# EAGLE design sensors (EAGLE 7.7.0)
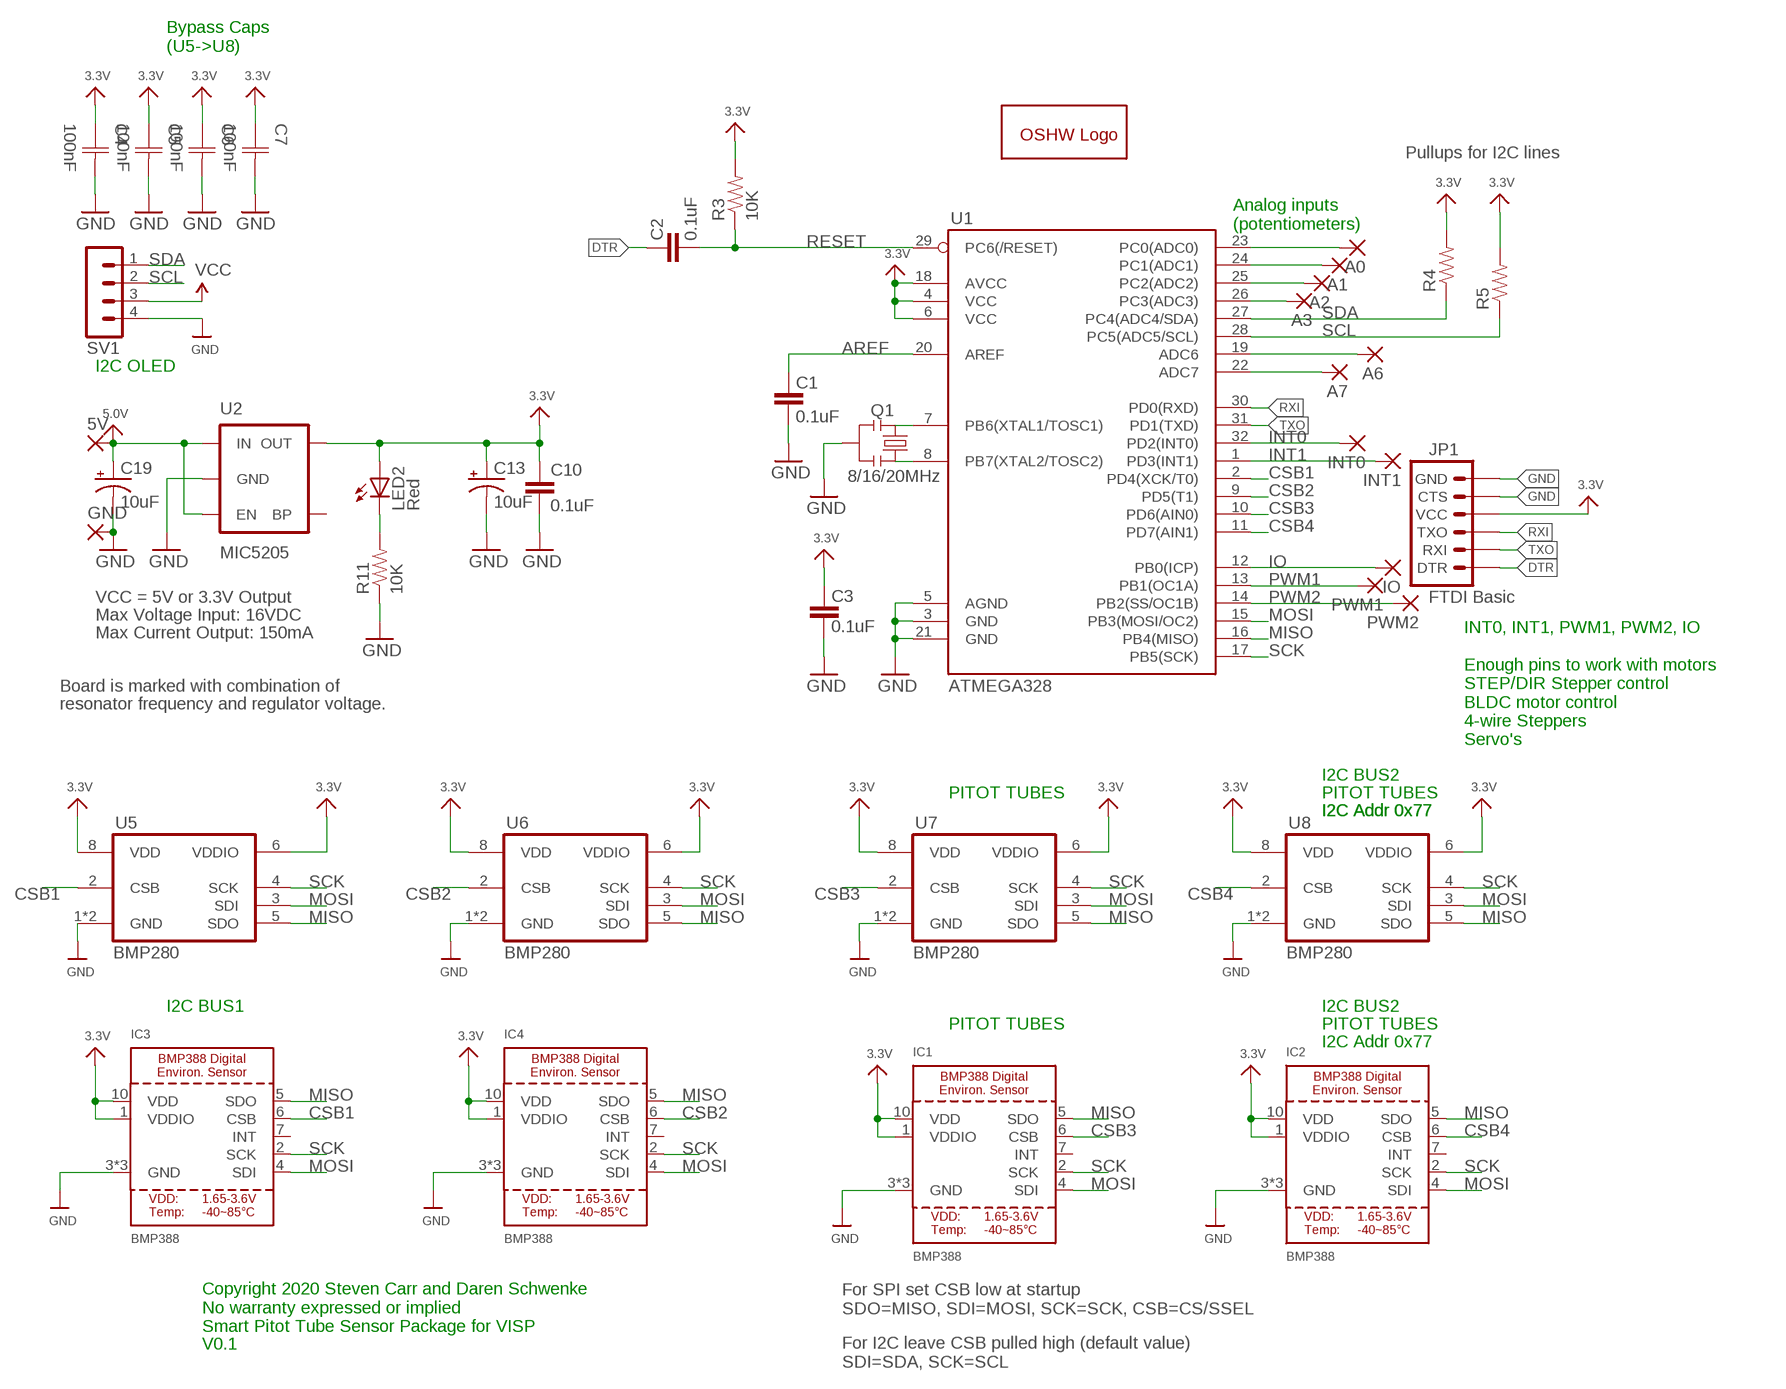
[diagram p0: schematic, sheet 1]

## Parts
5V  SMD2  [SMD1,27-2,54]
A0  SMD2  [SMD1,27-2,54]
A1  SMD2  [SMD1,27-2,54]
A2  SMD2  [SMD1,27-2,54]
A3  SMD2  [SMD1,27-2,54]
A6  SMD2  [SMD1,27-2,54]
A7  SMD2  [SMD1,27-2,54]
C1  0.1uF  CAP0603-CAP  [0603-CAP]
C2  0.1uF  CAP0603-CAP  [0603-CAP]
C3  0.1uF  CAP0603-CAP  [0603-CAP]
C4  100nF  CAPACITOR-0402  [CAP0402]
C5  100nF  CAPACITOR-0402  [CAP0402]
C6  100nF  CAPACITOR-0402  [CAP0402]
C7  100nF  CAPACITOR-0402  [CAP0402]
C10  0.1uF  CAP0603-CAP  [0603-CAP]
C13  10uF  CAP_POL1206  [EIA3216]
C19  10uF  CAP_POL1206  [EIA3216]
GND  SMD2  [SMD1,27-2,54]
GOLD_ORB_SM1  OSHWLOGOLOGO8MM  [OSHW_8MM]
IC1  BMP388  [BMP388]
IC2  BMP388  [BMP388]
IC3  BMP388  [BMP388]
IC4  BMP388  [BMP388]
INT0  SMD2  [SMD1,27-2,54]
INT1  SMD2  [SMD1,27-2,54]
IO  SMD2  [SMD1,27-2,54]
JP1  FTDI Basic  ARDUINO_SERIAL_PROGRAMPTH  [1X06]
LED2  Red  LED  [0603-LED-ALT1]
PWM1  SMD2  [SMD1,27-2,54]
PWM2  SMD2  [SMD1,27-2,54]
Q1  8/16/20MHz  RESONATOR1:1  [RESONATOR-SMD-1:1]
R3  10K  RESISTOR0603-RES  [0603-RES]
R4  RESISTOR0603-RES  [0603-RES]
R5  RESISTOR0603-RES  [0603-RES]
R11  10K  RESISTOR0603-RES  [0603-RES]
SV1  MA04-1  [MA04-1]
U1  ATMEGA328  ATMEGA168  [TQFP32-08]
U2  MIC5205  V_REG_LDOSMD  [SOT23-5]
U5  BMP280  [BMP280]
U6  BMP280  [BMP280]
U7  BMP280  [BMP280]
U8  BMP280  [BMP280]

## Nets
3.3V: C3.2 C4.1(C1) C5.1(C1) C6.1(C1) C7.1(C1) C10.1 C13.A(+) IC1.1(VDDIO) IC1.10(VDD) IC2.1(VDDIO) IC2.10(VDD) IC3.1(VDDIO) IC3.10(VDD) IC4.1(VDDIO) IC4.10(VDD) JP1.4(VCC) LED2.A R3.2 R4.2 R5.2 SV1.3 U1.4(VCC) U1.6(VCC) U1.18(AVCC) U2.5(OUT) U5.6(VDDIO) U5.8(VDD) U6.6(VDDIO) U6.8(VDD) U7.6(VDDIO) U7.8(VDD) U8.6(VDDIO) U8.8(VDD) ; supply symbol labelled VCC
5.0V: 5V.1(P) C19.A(+) U2.1(IN) U2.3(EN)
A0: A0.1(P) U1.23(PC0(ADC0))
A1: A1.1(P) U1.24(PC1(ADC1))
A2: A2.1(P) U1.25(PC2(ADC2))
A3: A3.1(P) U1.26(PC3(ADC3))
A6: A6.1(P) U1.19(ADC6)
A7: A7.1(P) U1.22(ADC7)
AREF: C1.2 U1.20(AREF)
CSB1: IC3.6(CSB) U1.2(PD4(XCK/T0)) U5.2(CSB)
CSB2: IC4.6(CSB) U1.9(PD5(T1)) U6.2(CSB)
CSB3: IC1.6(CSB) U1.10(PD6(AIN0)) U7.2(CSB)
CSB4: IC2.6(CSB) U1.11(PD7(AIN1)) U8.2(CSB)
DTR: C2.2 JP1.1(DTR)
GND: C1.1 C3.1 C4.2(C2) C5.2(C2) C6.2(C2) C7.2(C2) C10.2 C13.C(-) C19.C(-) GND.1(P) IC1.3(GND) IC1.8(GND) IC1.9(GND) IC2.3(GND) IC2.8(GND) IC2.9(GND) IC3.3(GND) IC3.8(GND) IC3.9(GND) IC4.3(GND) IC4.8(GND) IC4.9(GND) JP1.5(CTS) JP1.6(GND) Q1.2 R11.1 SV1.4 U1.3(GND) U1.5(AGND) U1.21(GND) U2.2(GND) U5.1(GND) U5.7(GND) U6.1(GND) U6.7(GND) U7.1(GND) U7.7(GND) U8.1(GND) U8.7(GND)
INT0: INT0.1(P) U1.32(PD2(INT0))
INT1: INT1.1(P) U1.1(PD3(INT1))
IO: IO.1(P) U1.12(PB0(ICP))
MISO: IC1.5(SDO) IC2.5(SDO) IC3.5(SDO) IC4.5(SDO) U1.16(PB4(MISO)) U5.5(SDO) U6.5(SDO) U7.5(SDO) U8.5(SDO)
MOSI: IC1.4(SDI) IC2.4(SDI) IC3.4(SDI) IC4.4(SDI) U1.15(PB3(MOSI/OC2)) U5.3(SDI) U6.3(SDI) U7.3(SDI) U8.3(SDI)
N$1: Q1.3 U1.8(PB7(XTAL2/TOSC2))
N$2: Q1.1 U1.7(PB6(XTAL1/TOSC1))
N$4: LED2.C R11.2
PWM1: PWM1.1(P) U1.13(PB1(OC1A))
PWM2: PWM2.1(P) U1.14(PB2(SS/OC1B))
RESET: C2.1 R3.1 U1.29(PC6(/RESET))
RXI: JP1.3(TXO) U1.30(PD0(RXD))
SCK: IC1.2(SCK) IC2.2(SCK) IC3.2(SCK) IC4.2(SCK) U1.17(PB5(SCK)) U5.4(SCK) U6.4(SCK) U7.4(SCK) U8.4(SCK)
SCL: R5.1 SV1.2 U1.28(PC5(ADC5/SCL))
SDA: R4.1 SV1.1 U1.27(PC4(ADC4/SDA))
TXO: JP1.2(RXI) U1.31(PD1(TXD))
Unconnected: IC1.7(INT) IC2.7(INT) IC3.7(INT) IC4.7(INT) U2.4(BP)

## Notes on the sheet
- Bypass Caps
  (U5->U8)
- Pullups for I2C lines
- Analog inputs
  (potentiometers)
- I2C OLED
- VCC = 5V or 3.3V Output
- Max Voltage Input: 16VDC
- Max Current Output: 150mA
- Board is marked with combination of
- resonator frequency and regulator voltage.
- INT0, INT1, PWM1, PWM2, IO
  
  Enough pins to work with motors
  STEP/DIR Stepper control
  BLDC motor control
  4-wire Steppers
  Servo's
- I2C BUS2
- PITOT TUBES | PITOT TUBES
- I2C Addr 0x77 | I2C Addr 0x77
- I2C BUS1 | I2C BUS2
- PITOT TUBES | PITOT TUBES
- I2C Addr 0x77
- For SPI set CSB low at startup
  SDO=MISO, SDI=MOSI, SCK=SCK, CSB=CS/SSEL
- Copyright 2020 Steven Carr and Daren Schwenke
  No warranty expressed or implied
  Smart Pitot Tube Sensor Package for VISP
- V0.1
- For I2C leave CSB pulled high (default value)
  SDI=SDA, SCK=SCL

## Library data of the parts
5V A0 A1-A3 A6 A7 GND INT0 INT1 IO PWM1 PWM2 = wirepad:SMD2: SMD PAD
C1-C3 C10 = SparkFun:CAP: Capacitor Standard 0603 ceramic capacitor, and 0.1" leaded capacitor.
C4-C7 = Capacitor:CAPACITOR; MPN: CL10F104ZO8NNNC
C13 C19 = SparkFun:CAP_POL: Capacitor Polarized These are standard SMD and PTH capacitors. Normally 10uF, 47uF, and 100uF in electrolytic and tantalum varieties. Always verify the external diameter of the through hole cap, it varies with capacity, voltage, and manufacturer. The EIA devices should be standard.
GOLD_ORB_SM1 = oshw:OSHWLOGO: The OSHW logo for PCB layout
IC1-IC4 = microbuilder:BMP388; MPN: BMP388
JP1 = SparkFun:ARDUINO_SERIAL_PROGRAM
LED2 = Testing:LED: LEDs Standard schematic elements and footprints for 5mm, 3mm, 1206, and 0603 sized LEDs. 5mm - Spark Fun Electronics SKU : COM-00529 (and others)
Q1 = Testing:RESONATOR: Resonator Small SMD resonator. This is the itty bitty 10/20MHz resonators with built in caps. CSTCE10M0G55 and CSTCE20M0V53. Footprint for SMD has been used in SFE production for years, and does work okay. 1:1 is an attempt to get larger fillets on the sides so it will be easier to inspect these solders in our AOI machine. The pads have been minimized to match the actual metal under the resonator. To see this relation, it includes an image import of the bottom side of the component. Imported to scale on layer 200.
R3-R5 R11 = SparkFun:RESISTOR: Resistor Basic schematic elements and footprints for 0603, 1206, and PTH resistors.
SV1 = con-lstb:MA04-1: PIN HEADER; OC_FARNELL: unknown; OC_NEWARK: unknown
U1 = SparkFun:ATMEGA168
U2 = SparkFun:V_REG_LDO: Voltage Regulator LDO Standard 150mA LDO voltage regulator in SOT-23 layout. Micrel part MIC5205. BP (by-pass) pin is used to lower output noise with 470pF cap.
U5-U8 = bosch-bmp280:BMP280: The BMP280 is an absolute barometric pressure sensor especially designed for mobile applications. The sensor module is housed in an extremely compact 8-pin metal-lid LGA package with a footprint of only 2.0 × 2.5 mm2 and 0.95 mm package height. Its small dimensions and its low power consumption of 2.7 μA @1Hz allow the implementation in battery driven devices such as mobile phones, GPS modules or watches. The library has been designed by Richard Magdycz <https://www.facebook.com/groups/eaglecadsoftUK>; MPN: BMP280

## Net classes
0 default: width 0.203 mm
1 vcc: width 0.254 mm

## Board
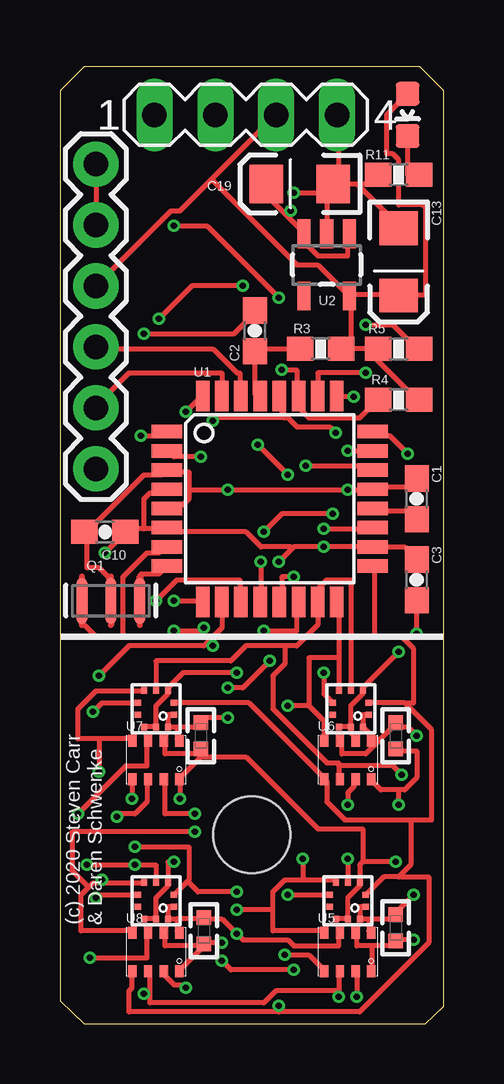
[diagram p1: board, top side]
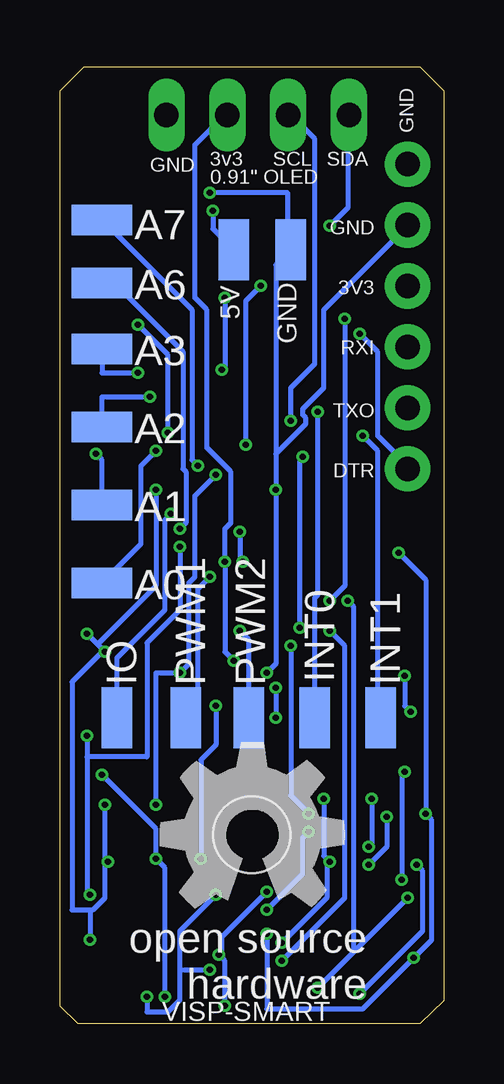
[diagram p2: board, bottom side, seen from below]

Size 16 x 39.88 mm. Coordinates in mm from the lower left corner, seen from the top.
Outline: 1,39.88 0,38.88 0,0.95 1,0 15.23,0 16,0.72 16,38.88 15,39.88 1,39.88
Copper layers (1*16): Top 0.035559375mm / dielectric 1.6mm / Bottom 0.035559375mm
Design rules "oshpark-2layer": minimum track width 6mil, minimum drill 10mil, track to track 6mil, track to pad 6mil, pad to pad 6mil, via to via 6mil, smd to smd 6mil, copper to edge 15mil, drill to drill 6mil, minimum pad ring 5mil, minimum via ring 5mil, stop-mask expansion 2.5mil, vias tented up to drill 0mil, thermal gap 10mil
Holes 3.2 mm at 8,7.88
vRestrict: area 2.8,2.8 to 5.2,5.2; area 10.8,2.8 to 13.2,5.2; area 2.8,10.8 to 5.2,13.2; area 10.8,10.8 to 13.2,13.2

### Footprints (pad centres in the part's own frame; a part is rotated, then mirrored left to right if it is on the bottom)
SMD1,27-2,54 = smd 1.27 x 2.54: 1 0,0
0603-CAP = smd 1.1 x 1: 1 -0.85,0; 2 0.85,0
CAP0402 = smd 0.6 x 0.6: 1 -0.55,0; 2 0.55,0
EIA3216 = smd 1.4 x 1.6: A 1.4,0; C -1.4,0
BMP388 = smd 0.25 x 0.275: 1 0.25,0.75; 2 -0.25,0.75; 6 -0.25,-0.75; 7 0.25,-0.75 | smd 0.275 x 0.25: 3 -0.762,0.5; 4 -0.762,0; 5 -0.762,-0.5; 8 0.762,-0.5; 9 0.762,0; 10 0.762,0.5
1X06 = drill 1.016 pad 1.88: 1 0,0; 2 2.54,0; 3 5.08,0; 4 7.62,0; 5 10.16,0; 6 12.7,0
0603-LED-ALT1 = smd 1 x 1: A 0,-0.877; C 0,0.877
RESONATOR-SMD-1:1 = smd 0.45 x 1.905: 1 -1.2,0; 2 0,0; 3 1.2,0
0603-RES = smd 1.1 x 1: 1 -0.85,0; 2 0.85,0
MA04-1 = drill 1.016 long: 1 -3.81,0; 2 -1.27,0; 3 1.27,0; 4 3.81,0
TQFP32-08 = smd 1.27 x 0.559: 1 -4.293,2.8; 2 -4.293,2; 3 -4.293,1.2; 4 -4.293,0.4; 5 -4.293,-0.4; 6 -4.293,-1.2; 7 -4.293,-2; 8 -4.293,-2.8; 17 4.293,-2.8; 18 4.293,-2; 19 4.293,-1.2; 20 4.293,-0.4; 21 4.293,0.4; 22 4.293,1.2; 23 4.293,2; 24 4.293,2.8 | smd 0.559 x 1.27: 9 -2.8,-4.293; 10 -2,-4.293; 11 -1.2,-4.293; 12 -0.4,-4.293; 13 0.4,-4.293; 14 1.2,-4.293; 15 2,-4.293; 16 2.8,-4.293; 25 2.8,4.293; 26 2,4.293; 27 1.2,4.293; 28 0.4,4.293; 29 -0.4,4.293; 30 -1.2,4.293; 31 -2,4.293; 32 -2.8,4.293
SOT23-5 = smd 0.55 x 1.2: 1 -0.95,-1.3; 2 0,-1.3; 3 0.95,-1.3; 4 0.95,1.3; 5 -0.95,1.3
BMP280 = smd 0.35 x 0.5: 1 0.975,-0.8; 2 0.325,-0.8; 3 -0.325,-0.8; 4 -0.975,-0.8; 5 -0.975,0.8; 6 -0.325,0.8; 7 0.325,0.8; 8 0.975,0.8

### Placement (x,y rotation side)
5V  8.75,32.25 0 bottom
A0  14.25,18.38 270 bottom
A1  14.25,21.62 270 bottom
A2  14.25,24.88 270 bottom
A3  14.25,28.12 270 bottom
A6  14.25,30.88 90 bottom
A7  14.25,33.5 90 bottom
C1  14.88,21.88 270 top
C2  8.12,28.88 90 top
C3  14.88,18.5 90 top
C4  5.88,12 270 top
C5  14,4 270 top
C6  6,3.88 270 top
C7  14,12 270 top
C10  1.88,20.5 180 top
C13  14.12,31.75 270 top
C19  10,35 180 top
GND  6.38,32.25 0 bottom
GOLD_ORB_SM1  8,7.88 0 bottom
IC1  4,13.12 270 top
IC2  4,5.12 270 top
IC3  12,5.12 270 top
IC4  12.12,13.12 270 top
INT0  5.38,12.75 180 bottom
INT1  2.62,12.75 180 bottom
IO  13.62,12.75 180 bottom
JP1  1.5,23.12 90 top
LED2  14.5,37.88 180 top
PWM1  10.75,12.75 180 bottom
PWM2  8.12,12.75 180 bottom
Q1  2.12,17.62 0 top
R3  10.88,28.12 0 top
R4  14.12,26 0 top
R5  14.12,28.12 180 top
R11  14.12,35.38 0 top
SV1  7.75,37.88 0 top
U1  8.75,21.88 0 top
U2  11.12,31.62 180 top
U5  12,3 0 top
U6  12,11 0 top
U7  4,11 0 top
U8  4,3 0 top

### Tracks (layer width: path | path; a pad name or v marks a point on that pad's centre or on a via)
3.3V  (via drill 0.25)
  Top 0.203: 12.75,28.12 R5.2 13.25,28.12 | 12.75,28.12 12.12,28.12 | 12.12,28.12 R3.2 11.75,28.12 | 12.75,28.12 14.88,26 R4.2 | 14.12,30.38 15.25,30.38 15.25,34 15.12,34.12 14.12,34.12 14.12,36 13.88,36.25 13.62,36.25 13.62,37.88 LED2.A | 14.12,30.38 12.12,30.38 U2.5 | 14.12,30.38 C13.A | 12.12,28.12 12.12,30.25 U2.5 | 6.31,35.19 5,33.88 4.62,33.88 JP1.4 | 6.31,35.19 9,37.88 SV1.3 | 6.31,35.19 9.88,31.62 10.75,31.62 12,30.38 U2.5 | 4.5,4.38 4.5,4.88 IC2.1 | 4.88,4.38 4.88,3.88 U8.8 | 4.5,4.38 4.88,4.38 | 4.5,4.38 IC2.10 | v1.25,2.75 3.62,2.75 3.62,3.75 U8.6 | 6,4.38 6.75,4.38 v7.38,3.75 7.62,3.5 9.5,3.5 9.75,3.25 11.62,3.25 11.62,3.75 U5.6 | v0.75,8.75 2.75,10.75 3.62,10.75 3.62,11.75 U7.6 | 6,4.38 4.88,4.38 | 6,4.38 C6.1 | 12.5,4.38 12.5,4.88 IC3.1 | 12.88,4.38 12.88,3.88 U5.8 | 12.5,4.38 12.88,4.38 | 12.5,4.38 IC3.10 | 12.88,4.38 13.88,4.38 14,4.5 C5.1 14,4.62 v14.75,5.38 | 12.62,12.38 12.62,12.88 IC4.1 | 13.31,11.81 14,12.5 C7.1 14,12.38 14.5,12.38 v14.88,12 | 13.31,11.81 13.19,11.69 | 13.19,11.69 12.75,11.25 11.75,11.25 11.75,11.75 U6.6 | U6.8 13,11.75 13.12,11.75 13.19,11.69 | 12.62,12.38 13.12,11.88 13.25,11.88 13.31,11.81 | 12.62,12.38 IC4.10 | 2.75,20.5 2.88,20.62 3.5,20.62 | 3.5,20.62 4.38,20.62 U1.6 4.5,20.62 4.62,20.5 7.75,20.5 8.38,19.88 9.62,19.88 9.69,19.81 | 3.5,20.62 3.5,21.88 3.75,22.12 4.25,22.12 4.38,22.25 U1.4 | 4.5,12.38 4.5,12.88 IC1.1 | 4.88,12.38 4.88,11.88 U7.8 | 4.5,12.38 4.88,12.38 | 4.5,12.38 IC1.10 | 4.88,12.38 5.75,12.38 5.88,12.5 C4.1 5.88,12.62 6,12.75 v7,12.75 | C3.2 14.88,19.38 14.38,19.88 U1.18 v11,19.88 9.75,19.88 9.69,19.81 | v7,14 7.62,14 v8.75,15.12 | 9.69,19.81 v9.12,19.25
  Top 0.203: 2.75,20.5 v1.88,19.62 | 2.75,20.5 C10.1
  Bottom 0.203: v7.38,3.75 7.38,0.62 3.38,0.62 v1.25,2.75 0.5,3.5 0.5,8.5 v0.75,8.75 0.75,18.5 v1.88,19.62 | v14.75,5.38 14.88,5.5 14.88,11.12 | v14.88,12 14.88,11.12 | v7,14 v7,12.75 | v8.75,15.12 9.12,15.5 v9.12,19.25 9.12,20.62 8.88,20.88 8.88,23 9.88,24 9.88,29.75 10.38,30.25 10.38,36.62 9.12,37.88 SV1.3 | 14.88,11.12 12.38,11.12 12.38,15.88 11,17.25 v11,19.88
5.0V  (via drill 0.25)
  Top 0.203: 9.44,33.69 8.62,34.5 8.62,35 C19.A | 9.44,33.69 10.12,33 U2.3 10.25,32.88 10.25,32.5 10.75,32 12,32 12,32.88 U2.1 | 9.44,33.69 v9.62,33.88
  Bottom 0.203: 5V.1 9.62,33.12 v9.62,33.88
A0  (via drill 0.25)
  Top 0.203: v12,23.88 U1.23
  Bottom 0.203: v12,23.88 12.62,23.25 12.62,20 A0.1
A1  (via drill 0.25)
  Top 0.203: v14.5,23.75 13.75,24.5 13.25,24.5 13.12,24.62 U1.24
  Bottom 0.203: v14.5,23.75 14.25,23.5 A1.1
A2  (via drill 0.25)
  Top 0.203: v12.25,26.12 11.62,26.12 U1.25
  Bottom 0.203: v12.25,26.12 14.25,26.12 A2.1
A3  (via drill 0.25)
  Top 0.203: U1.26 10.75,27.12 v12.75,27.12
  Bottom 0.203: v12.75,27.12 14.25,27.12 A3.1
A6  (via drill 0.25)
  Top 0.203: v11,20.62 13,20.62 U1.19
  Bottom 0.203: v11,20.62 10.75,20.88 10.75,23 10.88,23.12 10.88,28 13.75,30.88 A6.1
A7  (via drill 0.25)
  Top 0.203: v10.25,23.25 12.88,23.25 13,23.12 U1.22
  Bottom 0.203: v10.25,23.25 10.5,23.5 10.5,29.75 A7.1
AREF
  Top 0.203: C1.2 14.88,21.12 14.62,21.38 13.12,21.38 U1.20
CSB1  (via drill 0.25)
  Top 0.203: v9.5,5.38 IC3.6 | v12.38,1.12 12.38,2.12 U5.2 | v5.88,23.62 4.75,23.62 4.5,23.88 U1.2 | v6,16.5 5.88,16.38 v4.75,16.38 | v6.75,2.62 7.12,2.25 v9.75,2.25
  Bottom 0.203: v9.5,5.38 11,3.88 11,2.25 | 11,2.25 11,1 11.5,0.5 12.38,0.5 v12.38,1.12 | v5.88,23.62 6,23.5 v6,16.5 | v4.75,16.38 4.12,15.75 4.12,5.25 v6.75,2.62 | 11,2.25 v9.75,2.25
CSB2  (via drill 0.25)
  Top 0.203: IC4.6 11,13.75 v11,14.62 | v12,9.12 12,9.62 12.25,9.88 12.25,10.12 U6.2 | v4.75,17.62 5.88,17.62 U1.9 | v4.12,29.38 5.5,30.75 v7.62,30.75 | v9.5,22.88 v8.25,24.12
  Bottom 0.203: v12,9.12 12,14.62 v11,14.62 10.62,15 10.62,18.38 10.38,18.62 10.38,22 v9.5,22.88 | v4.75,17.62 4.12,18.25 v4.12,29.38 | v7.62,30.75 8.25,30.12 v8.25,24.12
CSB3  (via drill 0.25)
  Top 0.203: IC1.6 1.75,13.38 v1.38,13 | v1.62,14.5 2.88,15.75 6,15.75 6.19,15.94 | 6.19,15.94 6.75,16.5 U1.10 | v5.62,8.75 4.38,8.75 4.38,10.12 U7.2 | 6.19,15.94 v6.38,15.75
  Bottom 0.203: v1.38,13 1.62,13.25 v1.62,14.5 | v5.62,8.75 6.38,9.5 v6.38,15.75
CSB4  (via drill 0.25)
  Top 0.203: IC2.6 1.62,5.38 v1.5,5.25 | v5.25,1.5 5.12,1.62 4.75,1.62 4.25,2.12 U8.2 | v4,17.62 4.88,18.5 7.5,18.5 7.5,17.62 U1.11
  Bottom 0.203: v5.25,1.5 3.69,3.06 | 3.69,3.06 v1.5,5.25 | v4,17.62 3.75,17.38 3.75,3.12 3.69,3.06
DTR  (via drill 0.25)
  Top 0.203: v3.5,28.75 7.25,28.75 8.12,29.62 C2.2
  Bottom 0.203: v3.5,28.75 2.75,28 2.75,24.5 1.5,23.25 JP1.1
GND  (via drill 0.25)
  Top 0.203: U8.1 5,2.25 6,3.25 C6.2 | U8.7 4.38,3.75 4.38,3.25 5.88,3.25 C6.2 | 12,4.38 11.5,4.38 IC3.8 | 12,4.38 12,5.25 12.5,5.75 IC3.3 12.5,6.62 12.62,6.75 | 12,4.38 IC3.9 | 4,4.38 3.5,4.38 IC2.8 | 4,4.38 4,5.25 4.5,5.75 IC2.3 4.5,6.75 v4.75,6.75 | 4,4.38 IC2.9 | 5.94,11.19 6,11.25 6,11.38 5.88,11.38 C4.2 5.88,11.25 4.38,11.25 4.38,11.75 U7.7 | 5.94,11.19 5,10.25 U7.1 5,10.12 v5,9.38 | 12.62,6.75 12.62,8.12 10.75,8.12 7.75,11.12 6,11.12 5.94,11.19 | v6.75,3.38 6,3.38 C6.2 | 13,3.25 13.88,3.25 14,3.38 C5.2 14,3.5 v14.75,3.5 | 13,3.25 12.38,3.25 12.38,3.75 U5.7 | 13,3.25 13,2.25 U5.1 | 14.12,9.75 14.38,9.75 14.88,10.25 14.88,11.38 14,11.38 C7.2 | 14.12,9.75 13.38,9.75 13,10.12 U6.1 | 12.12,12.38 11.62,12.38 IC4.8 | 12.12,12.38 12.12,13.25 12.62,13.75 IC4.3 12.62,14 v14.12,15.5 | 12.12,12.38 IC4.9 12.12,12.12 12.25,12 12.25,11.88 U6.7 | v14.88,16.25 C3.1 | v14.12,9.12 14.12,9.75 | v14,6.75 12.62,6.75 | C1.1 14.88,22.62 14.62,22.38 13.12,22.38 U1.21 13,22.25 v12,22.25 v7,22.25 5.38,22.25 | 5.38,22.25 5.38,23 4.5,23 U1.3 4.38,23 4.25,22.88 3.5,22.88 1.12,20.5 | 5.38,22.25 5.38,21.88 5.12,21.62 4.62,21.62 4.5,21.5 U1.5 | 1.12,20.5 1.12,19 1.62,19 2,18.62 Q1.2 | 1.12,20.5 C10.2 | C19.C 11.62,35 | 11.62,35 12.38,35 | 12.38,35 12.88,35 13.25,35.38 R11.1 | 11.12,34.62 11.12,35 C19.C | 11.12,34.62 U2.2 | 12.38,35 14.12,33.25 C13.C | 11.62,35 11.62,37.88 SV1.4 | 11.5,35 C19.C | JP1.6 JP1.5 | 4,12.38 3.5,12.38 IC1.8 | 4,12.38 4,13.25 4.5,13.75 IC1.3 4.5,14 5.12,14.62 v7.38,14.62 | 4,12.38 IC1.9 | v9.75,34.62 11.12,34.62 | 11.12,34.62 C19.C
  Bottom 0.203: v5,9.38 5,7 v4.75,6.75 4.88,6.75 4.88,5.25 v6.75,3.38 | 14.44,15.81 v14.12,15.5 14.25,15.5 15.5,14.25 15.5,4.75 14.75,4.75 | 14.44,15.81 v14.88,16.25 | 14.12,6.75 14.12,5.25 14.62,4.75 14.75,4.75 | 14.12,6.75 v14.12,9.12 | 14.75,4.75 v14.75,3.5 | 14.12,6.75 v14,6.75 | v7.38,14.62 7,15 v7,22.25 7,23.75 | 7,23.75 7,31.62 GND.1 6.5,32.25 6.5,34.62 v9.75,34.62 | 7,23.75 5.75,25 5.75,25.25 5.88,25.38 5.88,25.62 5,26.5 5,29.75 1.5,33.25 JP1.5 | 14.44,15.81 12,18.25 v12,22.25
INT0  (via drill 0.25)
  Top 0.203: v5.25,25.5 5.88,26.12 U1.32
  Bottom 0.203: v5.25,25.5 5.25,17.88 5.38,17.75 INT0.1
INT1  (via drill 0.25)
  Top 0.203: v3.38,24.5 4.25,24.5 4.38,24.62 U1.1
  Bottom 0.203: v3.38,24.5 2.75,23.88 2.75,12.88 INT1.1
IO  (via drill 0.25)
  Top 0.203: v8.38,19.25 8.38,17.62 U1.12 | v8.5,20.5 9.25,21.25 v11.38,21.25
  Bottom 0.203: v8.38,19.25 8.5,19.38 v8.5,20.5 | v11.38,21.25 11.62,21 11.62,17.25 13.62,15.25 IO.1
MISO  (via drill 0.25)
  Top 0.203: 1.75,5.88 1.38,5.88 1.19,5.69 | 1.75,5.88 3.5,5.88 IC2.5 | 1.19,5.69 0.88,5.38 0.88,3.88 3,3.88 U8.5 | 1.62,11.88 3,11.88 U7.5 | 1.62,11.88 0.75,11.88 0.75,13.12 1.5,13.88 3.5,13.88 IC1.5 | v1.75,6 1.75,5.88 | 1.62,11.88 v1.62,10.5 | 10.12,6 9.38,6 8.88,5.5 8.88,4.75 | 10.12,6 11.5,6 IC3.5 | 8.88,4.75 8.88,3.88 11,3.88 U5.5 | 11.62,15.25 11.62,17.5 U1.16 | 11.62,15.25 IC4.5 | 10.38,13.25 11,12.62 11,11.88 U6.5 | 10.38,13.25 10.38,15.25 11.62,15.25 | v10.12,6.88 10.12,6 | 10.38,13.25 v9.5,13.25 | 1.19,5.69 0.5,6.38 0.5,8 v5.62,8 | 8.88,4.75 v7.38,4.75
  Bottom 0.203: v1.75,6 1.75,10.38 v1.62,10.5 | v10.12,6.88 10.12,11 9.5,11.62 v9.5,13.25 | v5.62,8 5.88,7.75 5.88,6.25 v7.38,4.75
MOSI  (via drill 0.25)
  Top 0.203: IC1.4 4,15.12 7.12,15.12 7.75,15.75 9.38,15.75 | 9.38,15.75 9.88,15.75 10.75,16.62 U1.15 10.75,18.12 11.12,18.5 12.12,18.5 IC4.4 | 11.62,10.75 11.62,10.88 11.12,10.88 8.88,13.12 8.88,14.5 9.38,15 9.38,15.75 | 11.62,10.75 11.62,10.25 U6.3 | IC2.4 4,6.62 v3.12,6.62 v1.12,6.62 | v2.38,8.62 2.5,8.75 3.12,8.75 3.62,9.25 3.62,10.12 U7.3 | v12,6.88 IC3.4 | 11.62,1.38 11.62,2.12 U5.3 | 3.75,1.25 3.75,0.88 8.5,0.88 9,1.38 11.62,1.38 | 3.75,1.25 3.75,2.12 U8.3 | 11.62,1.38 v11.62,1.12 | 3.75,1.25 v3.5,1.25 | 11.62,10.75 13.88,10.75 v14.25,10.38
  Bottom 0.203: v3.12,6.62 2.38,7.38 v2.38,8.62 | v11.62,1.12 11.62,6.5 v12,6.88 12,8.12 v14.25,10.38 | v1.12,6.62 0.88,6.38 0.88,3.88 v3.5,1.25
N$1
  Top 0.203: U1.8 4.38,19 4.12,18.75 3.38,18.75 Q1.3
N$2
  Top 0.203: U1.7 4.38,19.88 4.12,19.62 3.62,19.62 2.62,18.62 2.62,16.12 1.5,16.12 1,16.62 0.93,16.61
N$4
  Top 0.203: LED2.C 14.5,35.38 R11.2
PWM1  (via drill 0.25)
  Top 0.203: v9.75,18.62 9.25,18.62 9.25,17.62 U1.13
  Bottom 0.203: v9.75,18.62 10.25,18.12 10.25,13.25 PWM1.1
PWM2  (via drill 0.25)
  Top 0.203: v8.5,16.38 9.88,16.38 9.88,17.5 U1.14
  Bottom 0.203: v8.5,16.38 8.12,16 PWM2.1
RESET
  Top 0.203: U1.29 8.25,26.25 8.12,26.25 C2.1 8.12,28.12 R3.1
RXI
  Top 0.203: U1.30 7.5,26.25 7.5,27.12 7.38,27.12 6.38,28.12 1.5,28.12 JP1.3
SCK  (via drill 0.25)
  Top 0.203: 5.31,5.94 5.38,6 5.38,7.38 v3.12,7.38 | 5.31,5.94 IC2.2 | v3,9.38 3,10.12 U7.4 | IC3.2 13.5,6.12 14.12,6.12 14.19,6.19 | 14.19,6.19 14.62,6.62 14.62,8.5 | 14.62,8.5 11.88,8.5 11.12,9.25 11.12,10.12 U6.4 11,10.25 7.88,13.38 IC1.2 | IC4.2 14.38,13.38 14.44,13.31 | 14.44,13.31 15.5,12.25 15.5,8.5 14.62,8.5 | 9.12,0.5 12.5,0.5 15.38,3.38 15.38,6.12 14.25,6.12 14.19,6.19 | 9.12,0.5 2.88,0.5 2.88,1.38 3,1.5 3,2.12 U8.4 | v9.38,2.88 10.38,2.88 11,2.25 U5.4 | 9.12,0.5 v9.12,0.75 | U1.17 13.12,19 13.12,16.12 14.25,16.12 14.75,15.62 14.75,13.38 14.5,13.38 14.44,13.31 | 5.31,5.94 5.75,5.5 v7.38,5.5
  Bottom 0.203: v3.12,7.38 3,7.5 v3,9.38 | v9.12,0.75 9.12,2.62 v9.38,2.88 9.25,2.88 9.25,3.62 v7.38,5.5
SCL  (via drill 0.25)
  Top 0.203: v12.75,29.12 13.88,29.12 14.88,28.12 R5.1 | v11.5,24.62 11.25,24.88 9.88,24.88 9.44,25.31 | 9.44,25.31 9.25,25.5 9.25,26.12 U1.28 | v6.38,25.12 6.5,25.25 9.38,25.25 9.44,25.31
  Bottom 0.203: v12.75,29.12 11.5,27.88 v11.5,24.62 | v6.38,25.12 6.38,26.5 5.38,27.5 5.38,36.88 6.38,37.88 SV1.2
SDA  (via drill 0.25)
  Top 0.203: R4.1 13.25,26 12.5,25.25 10.38,25.25 10,25.62 10,26.12 U1.27 9.88,26.25 9.88,27.25 v9.25,27.25 | v9.12,30.25 6.12,33.25 v4.75,33.25
  Bottom 0.203: v9.25,27.25 9.12,27.38 v9.12,30.25 | v4.75,33.25 4,34 4,37.88 SV1.1
TXO
  Top 0.203: U1.31 6.75,27.12 2.88,27.12 1.5,25.75 JP1.2

### Text on the board
tNames: (c) 2020 Steven Carr / & Daren Schwenke
bNames: GND | SDA | SCL | 3v3 | GND | 0.91" OLED | GND | 3V3 | RXI | TXO | DTR | VISP-SMART